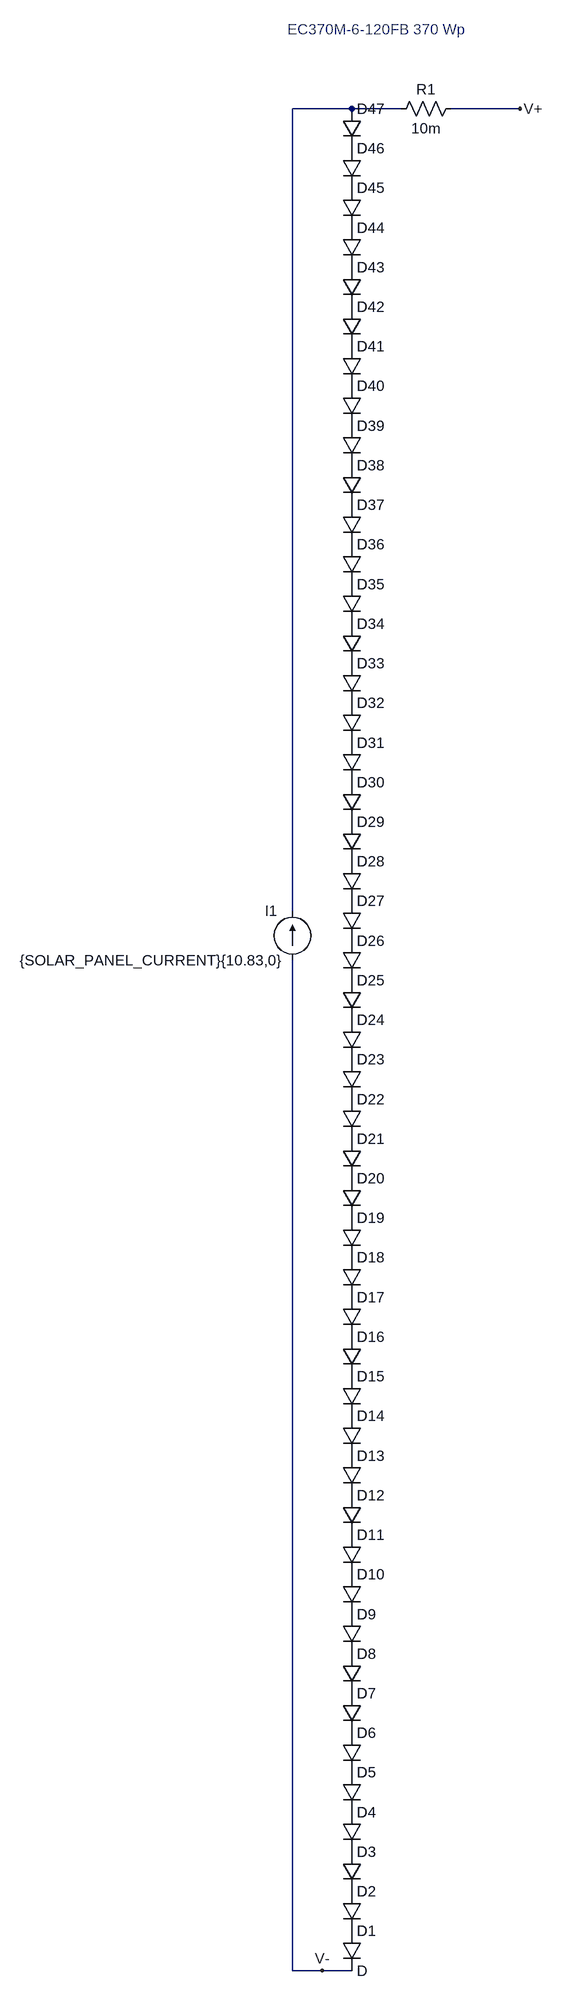
[diagram p0: schematic EC370M-6-120FB_370_Wp.asc]
EC370M-6-120FB_370_Wp.asc, the LTspice schematic file:
Version 4
SHEET 1 880 680
WIRE 96 -2848 0 -2848
WIRE 176 -2848 96 -2848
WIRE 368 -2848 256 -2848
WIRE 0 -1552 0 -2848
WIRE 0 160 0 -1472
WIRE 48 160 0 160
WIRE 96 160 48 160
FLAG 368 -2848 V+
FLAG 48 160 V-
SYMBOL diode 80 96 R0
SYMATTR InstName D1
SYMBOL current 0 -1472 R180
WINDOW 0 24 80 Left 2
WINDOW 3 24 0 Left 2
WINDOW 123 0 0 Left 0
WINDOW 39 0 0 Left 0
SYMATTR InstName I1
SYMATTR Value {SOLAR_PANEL_CURRENT}{10.83,0}
SYMBOL res 272 -2864 R90
WINDOW 0 0 56 VBottom 2
WINDOW 3 32 56 VTop 2
SYMATTR InstName R1
SYMATTR Value 10m
SYMBOL diode 80 32 R0
SYMATTR InstName D2
SYMBOL diode 80 -32 R0
SYMATTR InstName D3
SYMBOL diode 80 -96 R0
SYMATTR InstName D4
SYMBOL diode 80 -160 R0
SYMATTR InstName D5
SYMBOL diode 80 -224 R0
SYMATTR InstName D6
SYMBOL diode 80 -288 R0
SYMATTR InstName D7
SYMBOL diode 80 -352 R0
SYMATTR InstName D8
SYMBOL diode 80 -416 R0
SYMATTR InstName D9
SYMBOL diode 80 -480 R0
SYMATTR InstName D10
SYMBOL diode 80 -544 R0
SYMATTR InstName D11
SYMBOL diode 80 -608 R0
SYMATTR InstName D12
SYMBOL diode 80 -672 R0
SYMATTR InstName D13
SYMBOL diode 80 -736 R0
SYMATTR InstName D14
SYMBOL diode 80 -800 R0
SYMATTR InstName D15
SYMBOL diode 80 -864 R0
SYMATTR InstName D16
SYMBOL diode 80 -928 R0
SYMATTR InstName D17
SYMBOL diode 80 -992 R0
SYMATTR InstName D18
SYMBOL diode 80 -1056 R0
SYMATTR InstName D19
SYMBOL diode 80 -1120 R0
SYMATTR InstName D20
SYMBOL diode 80 -1184 R0
SYMATTR InstName D21
SYMBOL diode 80 -1248 R0
SYMATTR InstName D22
SYMBOL diode 80 -1312 R0
SYMATTR InstName D23
SYMBOL diode 80 -1376 R0
SYMATTR InstName D24
SYMBOL diode 80 -1440 R0
SYMATTR InstName D25
SYMBOL diode 80 -1504 R0
SYMATTR InstName D26
SYMBOL diode 80 -1568 R0
SYMATTR InstName D27
SYMBOL diode 80 -1632 R0
SYMATTR InstName D28
SYMBOL diode 80 -1696 R0
SYMATTR InstName D29
SYMBOL diode 80 -1760 R0
SYMATTR InstName D30
SYMBOL diode 80 -1824 R0
SYMATTR InstName D31
SYMBOL diode 80 -1888 R0
SYMATTR InstName D32
SYMBOL diode 80 -1952 R0
SYMATTR InstName D33
SYMBOL diode 80 -2016 R0
SYMATTR InstName D34
SYMBOL diode 80 -2080 R0
SYMATTR InstName D35
SYMBOL diode 80 -2144 R0
SYMATTR InstName D36
SYMBOL diode 80 -2208 R0
SYMATTR InstName D37
SYMBOL diode 80 -2272 R0
SYMATTR InstName D38
SYMBOL diode 80 -2336 R0
SYMATTR InstName D39
SYMBOL diode 80 -2400 R0
SYMATTR InstName D40
SYMBOL diode 80 -2464 R0
SYMATTR InstName D41
SYMBOL diode 80 -2528 R0
SYMATTR InstName D42
SYMBOL diode 80 -2592 R0
SYMATTR InstName D43
SYMBOL diode 80 -2656 R0
SYMATTR InstName D44
SYMBOL diode 80 -2720 R0
SYMATTR InstName D45
SYMBOL diode 80 -2784 R0
SYMATTR InstName D46
SYMBOL diode 80 -2848 R0
SYMATTR InstName D47
TEXT -8 -2976 Left 2 ;EC370M-6-120FB 370 Wp

The netlist it stands for:
* EC370M-6-120FB_370_Wp.asc
D1 P001 V- D
I1 V- N001 {SOLAR_PANEL_CURRENT}{10.83,0}
R1 V+ N001 10m
D2 P002 P001 D
D3 P003 P002 D
D4 P004 P003 D
D5 P005 P004 D
D6 P006 P005 D
D7 P007 P006 D
D8 P008 P007 D
D9 P009 P008 D
D10 P010 P009 D
D11 P011 P010 D
D12 P012 P011 D
D13 P013 P012 D
D14 P014 P013 D
D15 P015 P014 D
D16 P016 P015 D
D17 P017 P016 D
D18 P018 P017 D
D19 P019 P018 D
D20 P020 P019 D
D21 P021 P020 D
D22 P022 P021 D
D23 P023 P022 D
D24 P024 P023 D
D25 P025 P024 D
D26 P026 P025 D
D27 P027 P026 D
D28 P028 P027 D
D29 P029 P028 D
D30 P030 P029 D
D31 P031 P030 D
D32 P032 P031 D
D33 P033 P032 D
D34 P034 P033 D
D35 P035 P034 D
D36 P036 P035 D
D37 P037 P036 D
D38 P038 P037 D
D39 P039 P038 D
D40 P040 P039 D
D41 P041 P040 D
D42 P042 P041 D
D43 P043 P042 D
D44 P044 P043 D
D45 P045 P044 D
D46 P046 P045 D
D47 N001 P046 D
.model D D
.lib standard.dio
* EC370M-6-120FB 370 Wp
.backanno
.end